# EAGLE design VolCon (EAGLE 6.5.0)
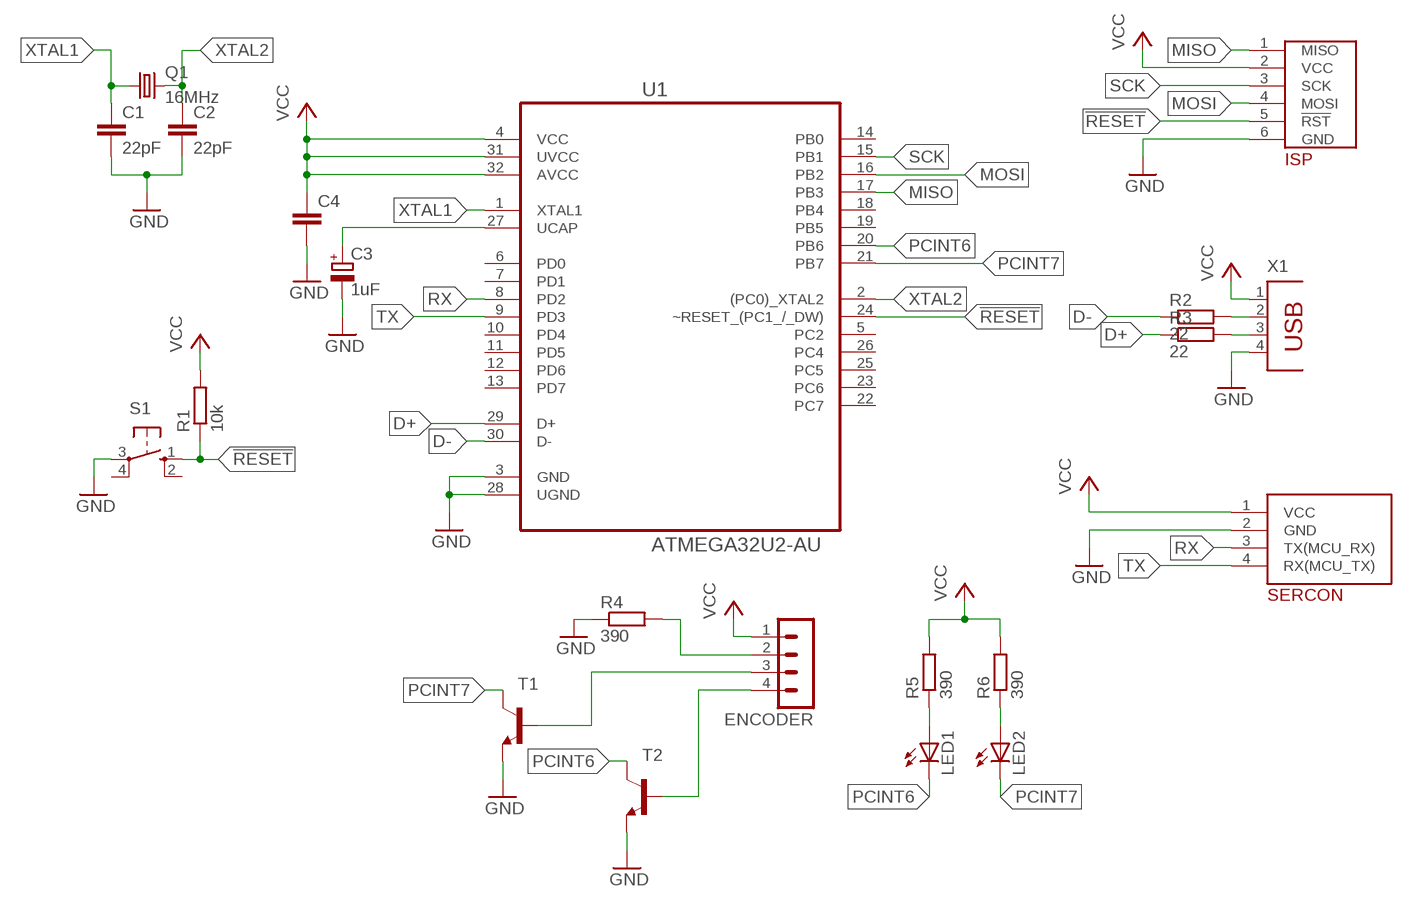
[diagram p0: schematic, sheet 1]

## Parts
C1  22pF  C-EU050-024X044  [C050-024X044]
C2  22pF  C-EU050-024X044  [C050-024X044]
C3  1uF  CPOL-EUE5-6  [E5-6]
C4  C-EU050-025X075  [C050-025X075]
ENCODER  MA04-1  [MA04-1]
LED1  LED5MM  [LED5MM]
LED2  LED5MM  [LED5MM]
Q1  16MHz  CRYSTALHC49S  [HC49/S]
R1  10k  R-EU_0204/7  [0204/7]
R2  22  R-EU_0204/7  [0204/7]
R3  22  R-EU_0204/7  [0204/7]
R4  390  R-EU_0204/7  [0204/7]
R5  390  R-EU_0204/7  [0204/7]
R6  390  R-EU_0204/7  [0204/7]
S1  10-XX  [B3F-10XX]
T1  2N3565  [TO92]
T2  2N3565  [TO92]
U1  ATMEGA32U2-AU  [QFP80P900X900X120-32N]
U$1  ISP-6  [ISP-6]
U$2  SERCON  [SERCON]
X1  PN61729  [PN61729]

## Nets
!RESET: R1.1 S1.1(S) U1.24(~RESET_(PC1_/_DW)) U$1.5(!RST)
D+: R3.1 U1.29(D+)
D-: R2.1 U1.30(D-)
GND: C1.2 C2.2 C3.- C4.2 R4.1 S1.3(P) T1.3(E) T2.3(E) U1.3(GND) U1.28(UGND) U$1.6(GND) U$2.2(GND) X1.4
MISO: U1.17(PB3) U$1.1(MISO)
MOSI: U1.16(PB2) U$1.4(MOSI)
N$1: R2.2 X1.2
N$2: R3.2 X1.3
N$3: ENCODER.3 T1.2(B)
N$4: ENCODER.4 T2.2(B)
N$5: ENCODER.2 R4.2
N$6: LED1.A R5.1
N$7: LED2.A R6.1
PCINT6: LED1.K(C) T2.1(C) U1.20(PB6)
PCINT7: LED2.K(C) T1.1(C) U1.21(PB7)
RX: U1.8(PD2) U$2.3(TX(MCU_RX))
SCK: U1.15(PB1) U$1.3(SCK)
TX: U1.9(PD3) U$2.4(RX(MCU_TX))
UCAP: C3.+ U1.27(UCAP)
VCC: C4.1 ENCODER.1 R1.2 R5.2 R6.2 U1.4(VCC) U1.31(UVCC) U1.32(AVCC) U$1.2(VCC) U$2.1(VCC) X1.1
XTAL1: C1.1 Q1.1 U1.1(XTAL1)
XTAL2: C2.1 Q1.2 U1.2((PC0)_XTAL2)
Unconnected: S1.2(S1) S1.4(P1) U1.5(PC2) U1.6(PD0) U1.7(PD1) U1.10(PD4) U1.11(PD5) U1.12(PD6) U1.13(PD7) U1.14(PB0) U1.18(PB4) U1.19(PB5) U1.22(PC7) U1.23(PC6) U1.25(PC5) U1.26(PC4)

## Library data of the parts
C1 C2 C4 = rcl:C-EU: CAPACITOR, European symbol
C3 = rcl:CPOL-EU: POLARIZED CAPACITOR, European symbol
ENCODER = con-lstb:MA04-1: PIN HEADER; OC_FARNELL: unknown; OC_NEWARK: unknown
LED1 LED2 = led:LED: LED OSRAM: - CHIPLED LG R971, LG N971, LY N971, LG Q971, LY Q971, LO R971, LY R971 LH N974, LH R974 LS Q976, LO Q976, LY Q976 LO Q996 - Hyper CHIPLED LW Q18S LB Q993, LB Q99A, LB R99A - SideLED LS A670, LO A670, LY A670, LG A670, LP A670 LB A673, LV A673, LT A673, LW A673 LH A674 LY A675 LS A676, LA A676, LO A676, LY A676, LW A676 LS A679, LY A679, LG A679 - Hyper Micro SIDELED® LS Y876, LA Y876, LO Y876, LY Y876 LT Y87S - SmartLED LW L88C, LW L88S LB L89C, LB L89S, LG L890 LS L89K, LO L89K, LY L89K LS L896, LA L896, LO L896, LY L896 - TOPLED LS T670, LO T670, LY T670, LG T670, LP T670 LSG T670, LSP T670, LSY T670, LOP T670, LYG T670 LG T671, LOG T671, LSG T671 LB T673, LV T673, LT T673, LW T673 LH T674 LS T676, LA T676, LO T676, LY T676, LB T676, LH T676, LSB T676, LW T676 LB T67C, LV T67C, LT T67C, LS T67K, LO T67K, LY T67K, LW E67C LS E67B, LA E67B, LO E67B, LY E67B, LB E67C, LV E67C, LT E67C LW T67C LS T679, LY T679, LG T679 LS T770, LO T770, LY T770, LG T770, LP T770 LB T773, LV T773, LT T773, LW T773 LH T774 LS E675, LA E675, LY E675, LS T675 LS T776, LA T776, LO T776, LY T776, LB T776 LHGB T686 LT T68C, LB T68C - Hyper Mini TOPLED® LB M676 - Mini TOPLED Santana® LG M470 LS M47K, LO M47K, LY M47K Source: http://www.osram.convergy.de LUXEON: - LUMILED® LXK2-PW12-R00, LXK2-PW12-S00, LXK2-PW14-U00, LXK2-PW14-V00 LXK2-PM12-R00, LXK2-PM12-S00, LXK2-PM14-U00 LXK2-PE12-Q00, LXK2-PE12-R00, LXK2-PE12-S00, LXK2-PE14-T00, LXK2-PE14-U00 LXK2-PB12-K00, LXK2-PB12-L00, LXK2-PB12-M00, LXK2-PB14-N00, LXK2-PB14-P00, LXK2-PB14-Q00 LXK2-PR12-L00, LXK2-PR12-M00, LXK2-PR14-Q00, LXK2-PR14-R00 LXK2-PD12-Q00, LXK2-PD12-R00, LXK2-PD12-S00 LXK2-PH12-R00, LXK2-PH12-S00 LXK2-PL12-P00, LXK2-PL12-Q00, LXK2-PL12-R00 Source: www.luxeon.com KINGBRIGHT: KA-3528ASYC Source: www.kingbright.com
Q1 = crystal:CRYSTAL: CRYSTAL; OC_FARNELL: 1667008; OC_NEWARK: unknown
R1-R6 = rcl:R-EU_: RESISTOR, European symbol
S1 = switch-omron:10-XX: OMRON SWITCH; MPN: B3F-1000; OC_FARNELL: 176432; OC_NEWARK: 36M3542
T1 T2 = transistor:2N3565: NPN TRANSISTOR
U1 = Atmel_By_element14_Batch_1-00:ATMEGA32U2-AU: 8-bit Microcontroller with ISP Flash and USB Controller; MPN: ATMEGA32U2-AU; OC_FARNELL: 1748524; OC_NEWARK: 26R5632; PACKAGE: TQFP-32; SUPPLIER: Atmel
U$1 = ISP-6:ISP-6
U$2 = SERCON:SERCON
X1 = con-berg:PN61729: BERG USB connector; OC_FARNELL: unknown; OC_NEWARK: unknown

## Board
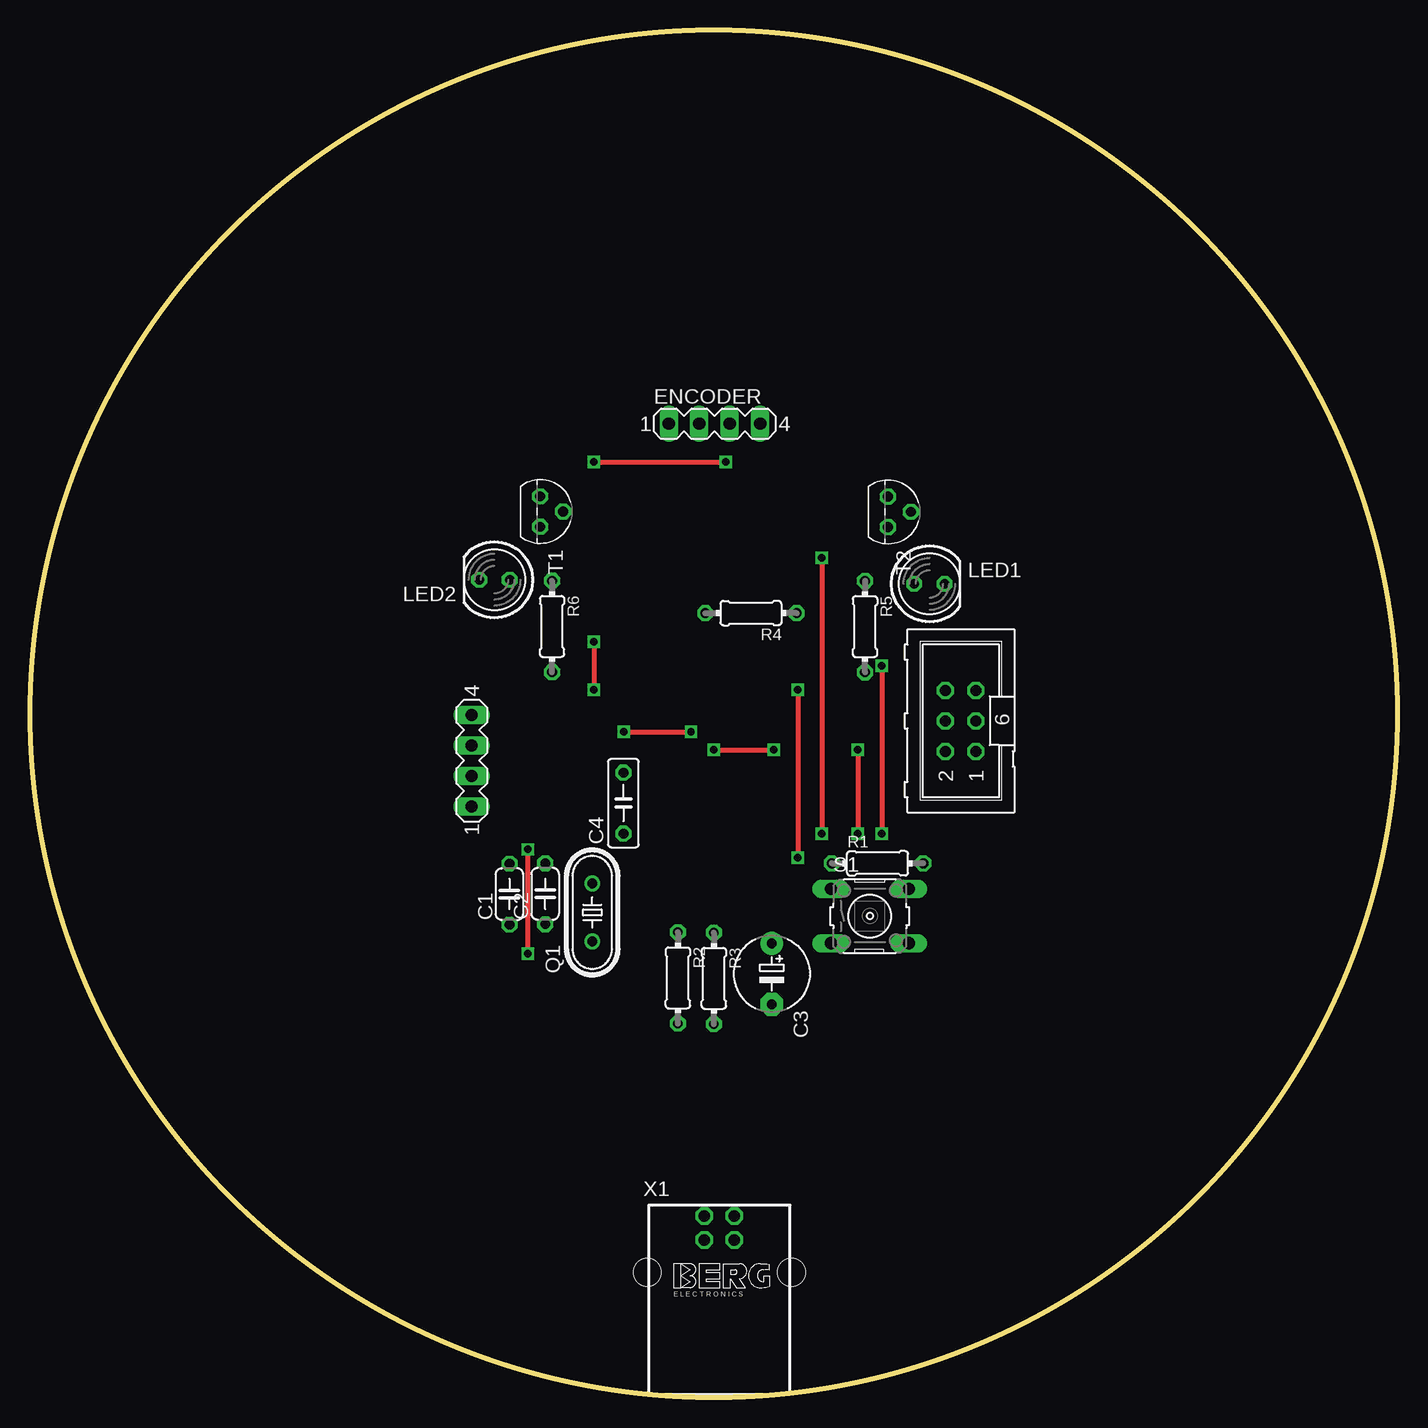
[diagram p1: board, top side]
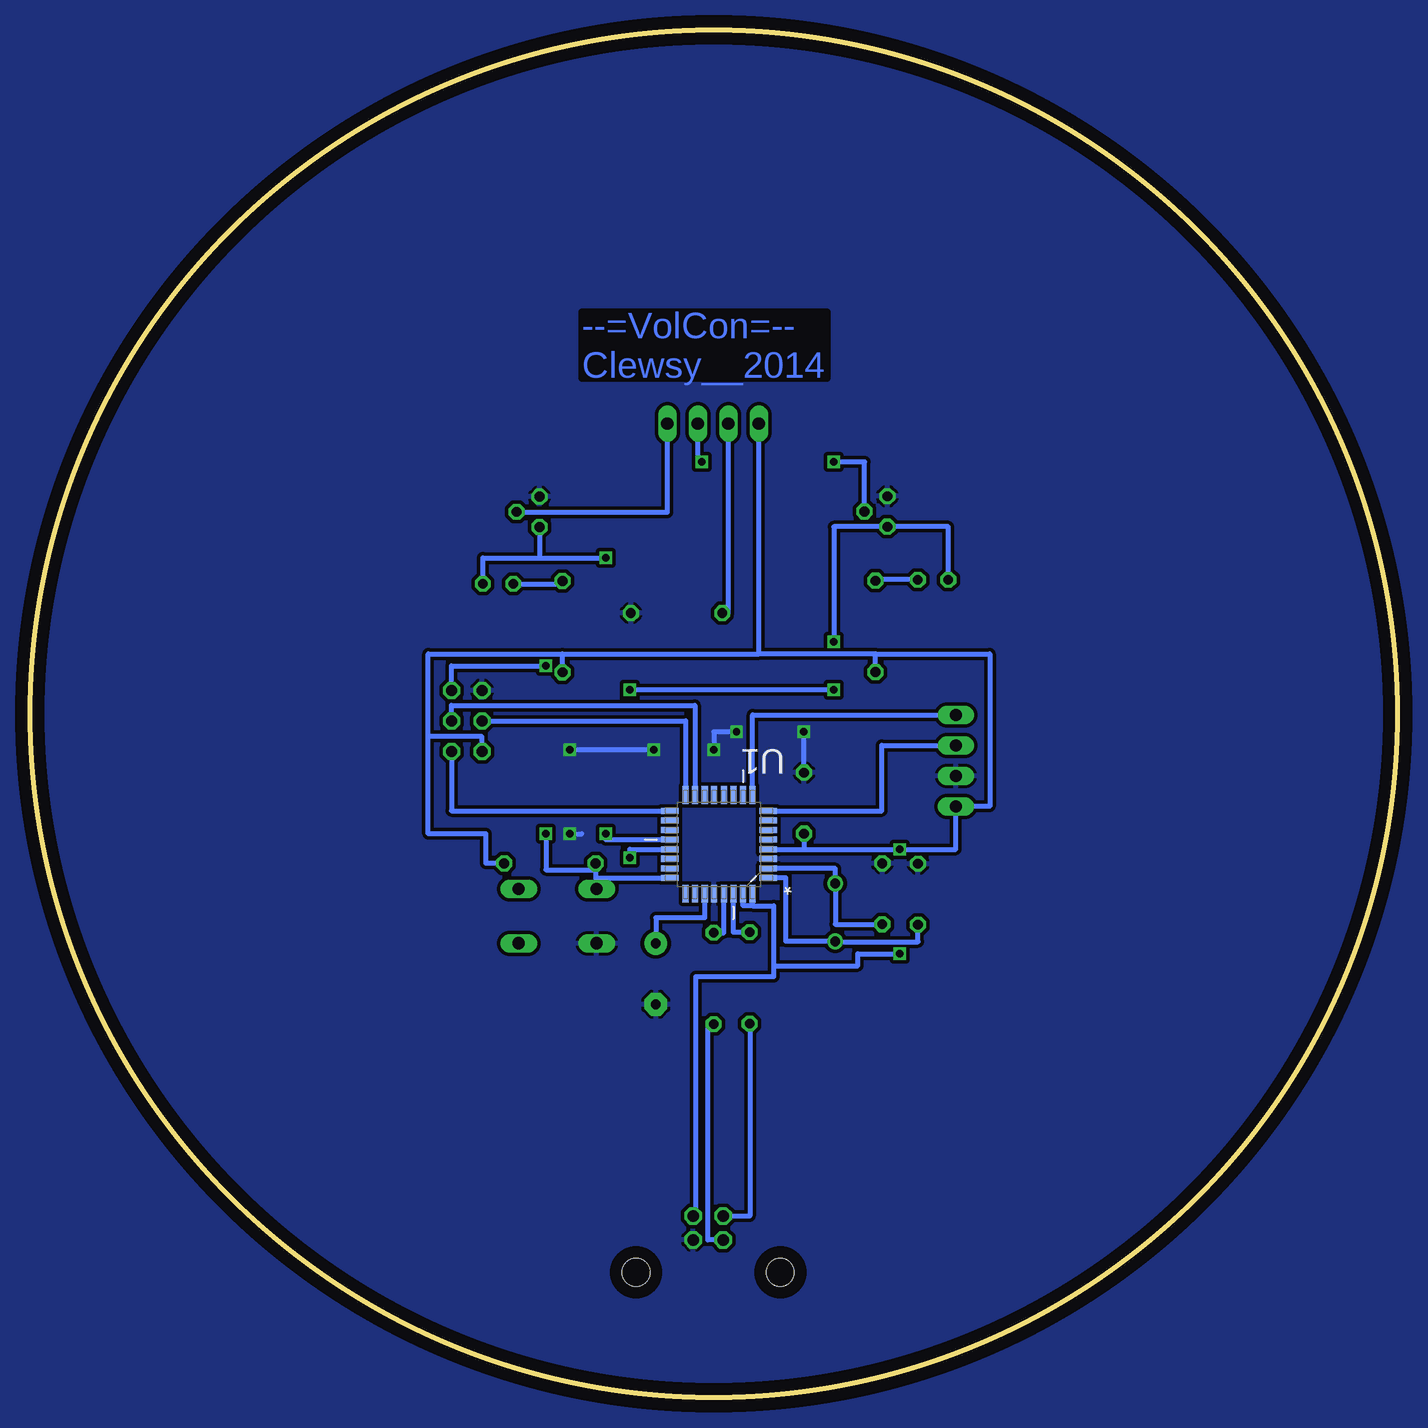
[diagram p2: board, bottom side, seen from below]

Size 114 x 114 mm. Coordinates in mm from the lower left corner, seen from the top.
Outline: circle at 57,57 radius 57
Copper layers (1*16): Top 0.035mm / dielectric 1.5mm / Bottom 0.035mm
Design rules "default *": minimum track width 10mil, minimum drill 20mil, track to track 8mil, track to pad 8mil, pad to pad 8mil, via to via 8mil, smd to smd 8mil, copper to edge 40mil, drill to drill 8mil, minimum pad ring 10mil, minimum via ring 8mil, stop-mask expansion 4mil, vias tented up to drill 0mil, thermal gap 10mil

### Footprints (pad centres in the part's own frame; a part is rotated, then mirrored left to right if it is on the bottom)
C050-024X044 = drill 0.813 octagon: 1 -2.54,0; 2 2.54,0
E5-6 = drill 0.813 pad 1.905: + -2.54,0 | drill 0.813 pad 1.905 octagon: - 2.54,0
C050-025X075 = drill 0.813 octagon: 1 -2.54,0; 2 2.54,0
MA04-1 = drill 1.016 long: 1 -3.81,0; 2 -1.27,0; 3 1.27,0; 4 3.81,0
LED5MM = drill 0.813 octagon: A -1.27,0; K 1.27,0
HC49/S = drill 0.813: 1 -2.413,0; 2 2.413,0
0204/7 = drill 0.813 octagon: 1 -3.81,0; 2 3.81,0
B3F-10XX = drill 1.016 long: 1 -3.251,2.261; 2 3.251,2.261; 3 -3.251,-2.261; 4 3.251,-2.261
TO92 = drill 0.813 octagon: 1 1.27,0; 2 0,1.905; 3 -1.27,0
QFP80P900X900X120-32N = smd 1.473 x 0.508: 1 -4.115,2.794; 2 -4.115,2.007; 3 -4.115,1.194; 4 -4.115,0.406; 5 -4.115,-0.406; 6 -4.115,-1.194; 7 -4.115,-2.007; 8 -4.115,-2.794; 17 4.115,-2.794; 18 4.115,-2.007; 19 4.115,-1.194; 20 4.115,-0.406; 21 4.115,0.406; 22 4.115,1.194; 23 4.115,2.007; 24 4.115,2.794 | smd 0.508 x 1.473: 9 -2.794,-4.115; 10 -2.007,-4.115; 11 -1.194,-4.115; 12 -0.406,-4.115; 13 0.406,-4.115; 14 1.194,-4.115; 15 2.007,-4.115; 16 2.794,-4.115; 25 2.794,4.115; 26 2.007,4.115; 27 1.194,4.115; 28 0.406,4.115; 29 -0.406,4.115; 30 -1.194,4.115; 31 -2.007,4.115; 32 -2.794,4.115
ISP-6 = drill 0.914 octagon: 1 -2.54,-1.27; 2 -2.54,1.27; 3 0,-1.27; 4 0,1.27; 5 2.54,-1.27; 6 2.54,1.27
SERCON = drill 1.016 long: 1 -3.81,0; 2 -1.27,0; 3 1.27,0; 4 3.81,0
PN61729 = drill 0.95 octagon: 1 1.25,4.71; 2 -1.25,4.71; 3 -1.25,2.71; 4 1.25,2.71 | hole 2.3: -6.02,0; 6.02,0

### Placement (x,y rotation side)
C1  39.97,41.96 90 top
C2  42.95,41.99 90 top
C3  61.83,35.32 270 top
C4  49.47,49.55 90 top
ENCODER  57.06,81.18 0 top
LED1  74.98,67.83 0 top
LED2  38.72,68.17 180 top
Q1  46.87,40.44 90 top
R1  70.66,44.53 0 top
R2  54.01,34.98 270 top
R3  57.01,34.94 270 top
R4  60.1,65.39 180 top
R5  69.61,64.26 270 top
R6  43.52,64.28 270 top
S1  70.01,40.13 0 top
T1  42.53,73.86 270 top
T2  71.53,73.83 270 top
U1  56.56,46.11 180 bottom
U$1  77.6,56.41 90 top
U$2  36.82,53.09 90 top
X1  57.47,10.43 0 top

### Tracks (layer width: path | path; a pad name or v marks a point on that pad's centre or on a via)
!RESET  (via drill 0.6)
  Top 0.406: v71,61 v71,47
  Bottom 0.406: U1.24 66.76,43.32 S1.1 66.85,42.39 66.85,44 | R1.1 66.85,44 | U$1.5 78.87,61 v71,61 | v71,47 71,44 66.85,44
D+
  Bottom 0.406: R3.1 56.15,38.75 U1.29
D-
  Bottom 0.406: R2.1 55.37,38.79 U1.30
GND  (via drill 0.6)
  Top 0.406: v49.5,55.5 v55.1,55.5 | v57,54 v62,54 | v69,54 v69,47
  Bottom 0.406: C4.2 49.5,52.09 v49.5,55.5 | v55.1,55.5 57,55.5 v57,54 | v62,54 v69,54 | v69,47 68,47
  pour Bottom (isolate 0.305): -6,119 119,119 119,-5 -6,-5
MISO
  Bottom 0.406: U$1.1 78.87,48.9 U1.17
MOSI
  Bottom 0.406: U$1.4 59.35,56.41 U1.16
N$1
  Bottom 0.406: R2.2 54,15.14 X1.2
N$2
  Bottom 0.406: X1.3 57.5,13.14 57.5,31 57.01,31 R3.2
N$3  (via drill 0.6)
  Top 0.406: v47,78 v58,78
  Bottom 0.406: T1.2 44.44,78 v47,78 | v58,78 58.33,78 ENCODER.3
N$4
  Bottom 0.406: T2.2 73.44,73.8 60.87,73.8 ENCODER.4
N$5
  Bottom 0.406: 55.79,80.39 ENCODER.2 55.79,65.39 R4.2
N$6
  Bottom 0.406: LED1.A 69.61,67.83 R5.1
N$7
  Bottom 0.406: LED2.A 43.52,68.17 R6.1
PCINT6  (via drill 0.6)
  Top 0.406: v66,70 v66,47
  Bottom 0.406: T2.1 71.53,70 | 71.53,70 v66,70 | v66,47 66,46.52 U1.20 | LED1.K 76.25,70 71.53,70
PCINT7  (via drill 0.6)
  Top 0.406: v47,63 v47,59 | v64,59 v64,45
  Bottom 0.406: LED2.K 37.45,72.59 T1.1 47,72.59 v47,63 | v47,59 v64,59 | v64,45 64,45.7 U1.21
RX
  Bottom 0.406: U1.8 43,48.9 43,54.36 U$2.3
SCK
  Bottom 0.406: U$1.3 78.87,57.7 58.57,57.7 U1.15
TX
  Bottom 0.406: U1.9 53.77,56.9 U$2.4
UCAP
  Bottom 0.406: U1.27 57.75,40 61.83,40 C3.+
VCC  (via drill 0.6)
  Top 0.406: v41.5,37 v41.5,45.7
  Bottom 0.406: U1.4 49.47,45.7 | 49.47,45.7 v41.5,45.7 36.82,45.7 U$2.1 34,49.28 34,62 43.52,62 | C4.1 49.47,45.7 | X1.1 58.5,15.14 58.5,35.1 52,35.1 52,36 | 52,36 52,41 53.77,41 | 53.77,41 53.8,41 | 53.8,41 54.55,41 U1.31 | 53.8,41 53.8,42 U1.32 53.77,41 | U$1.2 76.33,55.1 80.8,55.1 | 80.8,55.1 80.8,62 69.61,62 | R1.2 76,44.53 76,47 80.8,47 80.8,55.1 | 69.61,62 53.25,62 | R6.2 43.52,62 | R5.2 69.61,62 | 43.52,62 53.25,62 | 53.25,62 ENCODER.1 | 52,36 45,36 45,37 v41.5,37
XTAL1
  Bottom 0.406: U1.1 51,43.32 51,38.03 Q1.1 46.87,38 39.97,38 C1.1
XTAL2
  Bottom 0.406: Q1.2 46.87,44.1 U1.2 | 46.87,43.45 Q1.2 | Q1.2 46.87,39.45 C2.1

### Text on the board
Bottom: --=VolCon=-- / Clewsy__2014